# EAGLE design Thermorad-A (EAGLE 6.3)
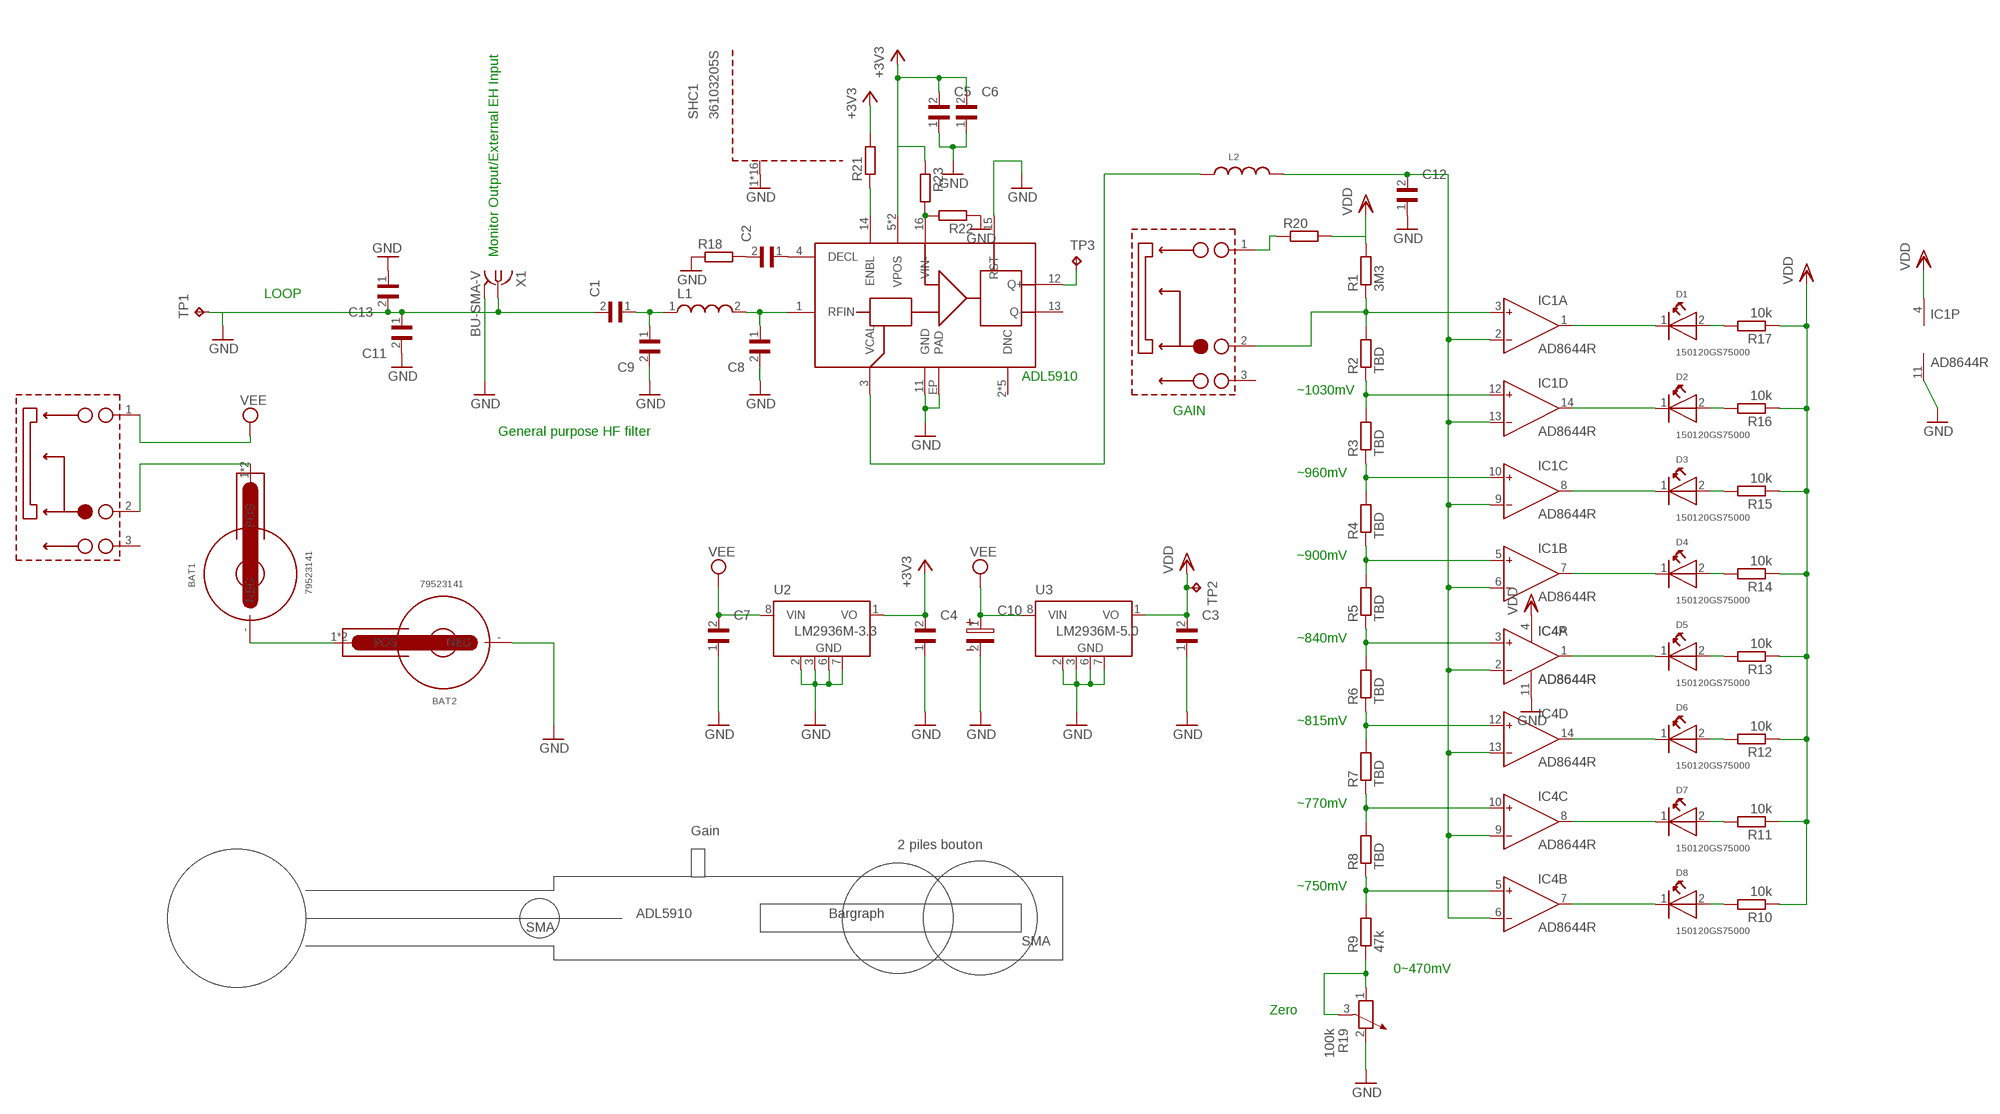
[diagram p0: schematic, sheet 1]

## Parts
BAT1  79523141  WA-BCMC_SMT_79523141  [79523141]
BAT2  79523141  WA-BCMC_SMT_79523141  [79523141]
C1  WCAP-CSGP_0805-REFLOW  [WCAP-CSGP_0805_REFLOW]
C2  WCAP-CSGP_0805-REFLOW  [WCAP-CSGP_0805_REFLOW]
C3  WCAP-CSGP_0805-REFLOW  [WCAP-CSGP_0805_REFLOW]
C4  WCAP-CSGP_0805-REFLOW  [WCAP-CSGP_0805_REFLOW]
C5  WCAP-CSGP_0805-REFLOW  [WCAP-CSGP_0805_REFLOW]
C6  WCAP-CSGP_0805-REFLOW  [WCAP-CSGP_0805_REFLOW]
C7  WCAP-CSGP_0805-REFLOW  [WCAP-CSGP_0805_REFLOW]
C8  WCAP-CSGP_0805-REFLOW  [WCAP-CSGP_0805_REFLOW]
C9  WCAP-CSGP_0805-REFLOW  [WCAP-CSGP_0805_REFLOW]
C10  WCAP-ASLI_5X5.5(DXL)  [3X1.6X1.4(BXCXA)]
C11  WCAP-CSGP_0805-REFLOW  [WCAP-CSGP_0805_REFLOW]
C12  WCAP-CSGP_0805-REFLOW  [WCAP-CSGP_0805_REFLOW]
C13  WCAP-CSGP_0805-REFLOW  [WCAP-CSGP_0805_REFLOW]
D1  150120GS75000  WL-SMCW-150120GS75000-G  [1206]
D2  150120GS75000  WL-SMCW-150120GS75000-G  [1206]
D3  150120GS75000  WL-SMCW-150120GS75000-G  [1206]
D4  150120GS75000  WL-SMCW-150120GS75000-G  [1206]
D5  150120GS75000  WL-SMCW-150120GS75000-G  [1206]
D6  150120GS75000  WL-SMCW-150120GS75000-G  [1206]
D7  150120GS75000  WL-SMCW-150120GS75000-G  [1206]
D8  150120GS75000  WL-SMCW-150120GS75000-G  [1206]
IC1  AD8644R  [SO14]
IC4  AD8644R  [SO14]
L1  WE-KI_0805A  [WE-KI_0805A]
L2  WE-CBF_0805_74279209_WB_HS  [WE-CBF_0805(W=3.0)]
R1  3M3  R-EU_M0805  [M0805]
R2  TBD  R-EU_M0805  [M0805]
R3  TBD  R-EU_M0805  [M0805]
R4  TBD  R-EU_M0805  [M0805]
R5  TBD  R-EU_M0805  [M0805]
R6  TBD  R-EU_M0805  [M0805]
R7  TBD  R-EU_M0805  [M0805]
R8  TBD  R-EU_M0805  [M0805]
R9  47k  R-EU_M0805  [M0805]
R10  10k  R-EU_M0805  [M0805]
R11  10k  R-EU_M0805  [M0805]
R12  10k  R-EU_M0805  [M0805]
R13  10k  R-EU_M0805  [M0805]
R14  10k  R-EU_M0805  [M0805]
R15  10k  R-EU_M0805  [M0805]
R16  10k  R-EU_M0805  [M0805]
R17  10k  R-EU_M0805  [M0805]
R18  R-EU_R0603  [R0603]
R19  100k  POTENTIOMETER_PT_SPIN  [PT-SPIN]
R20  R-EU_M0805  [M0805]
R21  R-EU_R0603  [R0603]
R22  R-EU_R0603  [R0603]
R23  R-EU_R0603  [R0603]
SHC1  36103205S  WE-SHC_36103205S  [WE-SHC_36103205S]
SW1  450404015514  [450404015514]
SW2  450404015514  [450404015514]
TP1  TPB2,54  [B2,54]
TP2  TPB2,54  [B2,54]
TP3  TPB1,27  [B1,27]
U1  ADL5910  [LFCSP-16]
U2  LM2936M-3.3  [SO08]
U3  LM2936M-5.0  [SO08]
X1  BU-SMA-V  [BU-SMA-V]

## Nets
+3V3: C4.2 C5.2 C6.2 R21.2 R23.1 U1.5(VPOS) U1.7(VPOS) U2.1(VO)
GND: BAT2.-(NEG) C1.2 C3.1 C4.1 C5.1 C6.1 C7.1 C8.2 C9.2 C10.2 C11.1 C11.2 C12.1 C13.1 C13.2 IC1.11(P:V-) IC4.11(P:V-) R18.1 R19.2 R22.1 SHC1.1(GND) SHC1.2(GND) SHC1.3(GND) SHC1.4(GND) SHC1.5(GND) SHC1.6(GND) SHC1.7(GND) SHC1.8(GND) SHC1.9(GND) SHC1.10(GND) SHC1.11(GND) SHC1.12(GND) SHC1.13(GND) SHC1.14(GND) SHC1.15(GND) SHC1.16(GND) TP1.TP U1.11(GND) U1.15(RST) U1.EP(PAD) U2.2(GND) U2.3(GND) U2.6(GND) U2.7(GND) U3.2(GND) U3.3(GND) U3.6(GND) U3.7(GND) X1.1 X1.2(GND)
N$1: IC4.5(B:IN+) R8.1 R9.2
N$2: IC4.10(C:IN+) R7.1 R8.2
N$3: IC4.12(D:IN+) R6.1 R7.2
N$4: IC4.3(A:IN+) R5.1 R6.2
N$5: IC1.5(B:IN+) R4.1 R5.2
N$6: IC1.10(C:IN+) R3.1 R4.2
N$7: IC1.12(D:IN+) R2.1 R3.2
N$8: IC1.3(A:IN+) R1.1 R2.2 SW1.2
N$9: C1.1 C9.1 L1.1
N$10: D8.2(A) R10.2
N$11: C8.1 L1.2 U1.1(RFIN)
N$12: D3.1(K) IC1.8(C:OUT)
N$13: D4.1(K) IC1.7(B:OUT)
N$14: D5.1(K) IC4.1(A:OUT)
N$15: D6.1(K) IC4.14(D:OUT)
N$16: D7.1(K) IC4.8(C:OUT)
N$17: D8.1(K) IC4.7(B:OUT)
N$18: D2.1(K) IC1.14(D:OUT)
N$19: D1.1(K) IC1.1(A:OUT)
N$21: D7.2(A) R11.2
N$22: D6.2(A) R12.2
N$23: D5.2(A) R13.2
N$24: D4.2(A) R14.2
N$25: D3.2(A) R15.2
N$26: D2.2(A) R16.2
N$27: D1.2(A) R17.2
N$28: BAT1.1(POS) BAT1.2(POS) SW2.2
N$29: BAT1.-(NEG) BAT2.1(POS) BAT2.2(POS)
N$30: R20.1 SW1.1
N$31: C2.1 U1.4(DECL)
N$32: C2.2 R18.2
N$33: C12.2 IC1.2(A:IN-) IC1.6(B:IN-) IC1.9(C:IN-) IC1.13(D:IN-) IC4.2(A:IN-) IC4.6(B:IN-) IC4.9(C:IN-) IC4.13(D:IN-) L2.2
N$34: R9.1 R19.1 R19.3
N$35: L2.1 U1.3(VCAL)
N$36: R21.1 U1.14(ENBL)
N$38: R22.2 R23.2 U1.16(VIN-)
N$40: TP3.TP U1.12(Q+)
VDD: C3.2 IC1.4(P:V+) IC4.4(P:V+) R1.2 R10.1 R11.1 R12.1 R13.1 R14.1 R15.1 R16.1 R17.1 R20.2 TP2.TP U3.1(VO)
VEE: C7.2 C10.1 SW2.1 U2.8(VIN) U3.8(VIN)
Unconnected: SW1.3 SW2.3 U1.2(DNC) U1.6(DNC) U1.8(DNC) U1.9(DNC) U1.10(DNC) U1.13(Q-)

## Notes on the sheet
- Monitor Output/External EH Input
- LOOP
- ADL5910
- ~1030mV
- GAIN
- General purpose HF filter
- ~960mV
- ~900mV
- ~840mV
- ~815mV
- ~770mV
- Gain
- 2 piles bouton
- ~750mV
- ADL5910 | Bargraph
- SMA
- SMA
- 0~470mV
- Zero

## Power pins joined to a net without a drawn wire
GND: X1.3(GND) X1.4(GND) X1.5(GND)

## Library data of the parts
BAT1 BAT2 = EAGLE-BATTERY_HOLDERS:WA-BCMC: Battery Holder WA-BCMC Characteristics Material : Phosphor Bronze Surface:Nichel Comliance:Lead free and RoHs Packaging unit is 500 <http://katalog.we-online.de/media/images/v2/Family_WA-BCMC_Battery_Holder_795xxxxx.jpg> Details see: http://katalog.we-online.de/en/em/BCMC_BATTERY_HOLDER/79523141 2015 (C) Wurth Elektronik
C1-C9 C11-C13 = Eagle_Wurth_Elektronik_Passive_Capacitors_rev15a:WCAP-CSGP: WCAP-CSGP Ceramic Capacitors Characteristics Multilayer Ceramic Chip Capacitor Recommended soldering:Reflow, for 0603 and 0805 wave soldering is also allowed Operating temperature:-55 °C to +125 °C; Ceramic characteristics: Class I - NPO ; Class II -X7R, X5R High performance ceramic High capacitance stability Minimal aging Termination:Cu/Ni/Sn <http://katalog.we-online.de/media/images/eisos/WCAP-CSGP_pf2.jpg> Details see: http://katalog.we-online.de/en/pbs/WCAP-CSGP/?m Created: 2015-01-28 2015 (C) Wurth Elektronik
C10 = Eagle_Wurth_Elektronik_Passive_Capacitors_rev15a:WCAP-ASLI: WCAP-ASLI Aluminum Electrolytic Capacitors Characteristics Aluminum Electrolytic Capacitor Recommended soldering: Reflow Operating temperature: -55 °C to +105 °C Low impedance product series Load life:2000 h @ +105 °C Package name and Variant abbreviation: Package: Package: B X C X A = length of the solder pad X width of the solder pad X pitch of the solder pad. Variant: D X L = Diameter of the body part X Height of the body part. <http://katalog.we-online.de/media/images/eisos/WCAP-ASLI_pf2.jpg> Details see: http://katalog.we-online.de/en/pbs/WCAP-ASLI?m Created: 2015-03-10 2015 (C) Wurth Elektronik
D1-D8 = Wurth_Elektronik_Optoelectronics_rev15b:WL-SMCW: SMD mono-color Chip LED Characteristics Low energy consumption High reliability Low current requirement Fast switching No UV/IR radiation Smallest SMD package with exceptional brightness Top view Wide viewing angle PBC high-usage Applications Backlight for mobile and portable device keypads Indoor and outdoor message boards Flat backlight for LCDs, switches and symbols Display for industrial control systems and traffic Miniaturized color effects Pedestrian mark Optical indicators General lighting Toys <http://katalog.we-online.de/media/images/eipal/WL-SMCW_pf2.jpg> Details see: http://katalog.we-online.de/en/led/WL-SMCW?m Updated 2015-04-10 2015 (C) Wurth Elektronik; COMPANY-URL: http://www.we-online.de; CREATED-BY: Christin Otto; CREATED-DATE: APR 2013; DATASHEET-URL: http://katalog.we-online.de/en/led/WL-SMCW?m=t&sq=smcw&sp=&sp=http%3A%2F%2Fwww.we-online.de%2Fweb%2Fen%2Felectronic_components%2Fsearchpage_PBS.php%3Fsearch%3Dsmcw#vs_t2:2; MANUFACTURER: Würth Elektronik eiSos GmbH
IC1 IC4 = analog-devices:AD8644: Single and Quad 18 V Operational Amplifiers Source: http://www.analog.com/static/imported-files/data_sheets/AD8614_8644.pdf; MF: ALTERA CORPORATION; MPN: AD8644ARZ; OC_FARNELL: 1438873; OC_NEWARK: 59K7037
L1 = EAGLE-EMC_COMPONENTS-rev17a:WE-KI: SMD Wire Wound Ceramic Inductor Characteristics WE-KI series offers you an excellent Q factor and highest possible self resonant frequencies up to 12.5 GHz Inductance tolerances: 5% (2% on request) High thermal stability Operating temperature: –40°C to +125°C Applications Especially developed for high frequency applications RF transceiver/communications Bluetooth Wireless LAN <http://katalog.we-online.de/media/images/v2/Family_WE-KI.jpg> Details see: http://katalog.we-online.de/en/pbs/WE-KI Updated by Dan Xu 2014-07-08 2014 (C) Wurth Elektronik
L2 = EMCComponents (rev19a):WE-CBF_0805: WE-CBF SMD EMI Suppression Ferrite Bead Characteristics Reliable Ni-Sn electrodes High rated current up to 6 A Operating temperature: –55 ºC to +125 ºC Applications Perfect as data lined filter and for uncoupling of distribution voltage Variant abbreviation WB means WIDE BAND HS means HIGH SPEED HC means HIGH CURRENT <http://katalog.we-online.de/media/images/v2/Family_WE-CBF.jpg> Details see: http://katalog.we-online.de/en/pbs/WE-CBF Updated on 2014-06-19 2014 (C) Wurth Elektronik; WE-NUMBER: 74279209/1200Ω(Z@100MHz)
R1-R17 R20 = resistor:R-EU_: RESISTOR, European symbol
R18 R21-R23 = rcl:R-EU_: RESISTOR, European symbol
R19 = rcl:POTENTIOMETER_: Potentiometer
SHC1 = EMCComponents (rev19a):WE-SHC: Shielding Cabinet Characteristics Tin plate in accordance with DIN EN 10202/10203 Shielding effectiveness up to 55 dB Two-part case consisting of a solderable grid frame (SMD/THT) and a removable cover Applications To prevent EMI radiation from PCB and to keep sensitivity low of: - RF output stages - RF input and amplifier stages; - Oscillators - EMC sensitive parts in plastic cases <http://katalog.we-online.de/media/images/v2/Family_WE-SHC_NEU_2017.jpg> Details see: http://katalog.we-online.de/en/pbs/WE-SHC?m Updated by Dan Xu 2014-07-11 2014 (C) Wurth Elektronik
SW1 SW2 = EAGLE-450404015514-rev1:450404015514: WS-SLSU Right angle Slide Switch with boss design Specification Rating 300mA, 12VDC Contact Resistance Initial:70mΩ max. After life test: 200mΩ max. Insulation Resistance: min.100MΩ at 500VDC Dielectric Strength : 250VAC for 1 minute Travel:1.5±0.15mm Operating force :150 ± 75g. Life cycle:10000 steps Switch function : ON-ON. Material Cover : : Stainless Steel Base :PA46 UL 94 HB,COLOR Black Frame :LCP UL 94 V-0, color Black Contact : :Copper Alloy with Silver Terminal : Copper Alloy with Silver 2015 (C) Wurth Elektronik
TP1-TP3 = testpad:TP: Test pad
U1 = LT:ADL5910
U2 = national-semiconductor:LM2936M?*: Ultra-Low Quiescent Current LDO Voltage Regulator Source: Data sheet <http://www.national.com/ds/LM/LM2936.pdf>; MF: NATIONAL SEMICONDUCTOR; MPN: LM2936M-3.3/NOPB; OC_FARNELL: 1469059; OC_NEWARK: 41K4514
U3 = national-semiconductor:LM2936M?*: Ultra-Low Quiescent Current LDO Voltage Regulator Source: Data sheet <http://www.national.com/ds/LM/LM2936.pdf>; MF: NATIONAL SEMICONDUCTOR; MPN: LM2936M-5.0/NOPB; OC_FARNELL: 9494421; OC_NEWARK: 41K4515
X1 = con-coax:BU-SMA-V: FEMALE SMA CONNECTOR Radiall distributor RS 112-3794; OC_FARNELL: unknown; OC_NEWARK: unknown

## Board
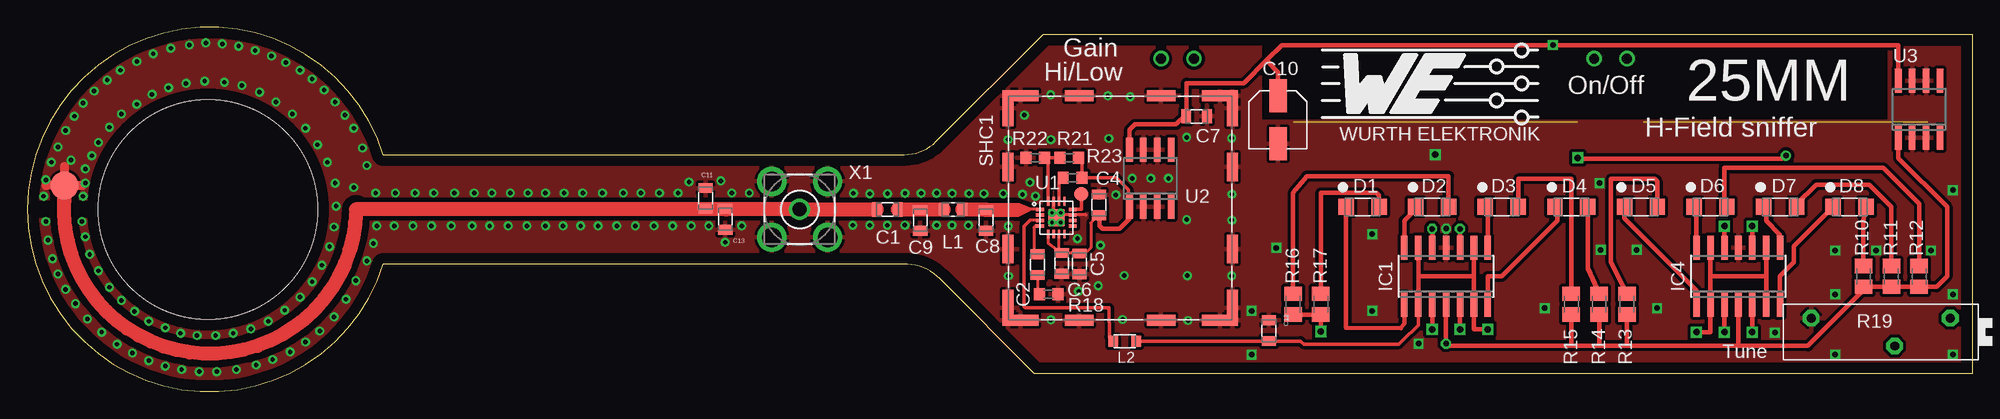
[diagram p1: board, top side]
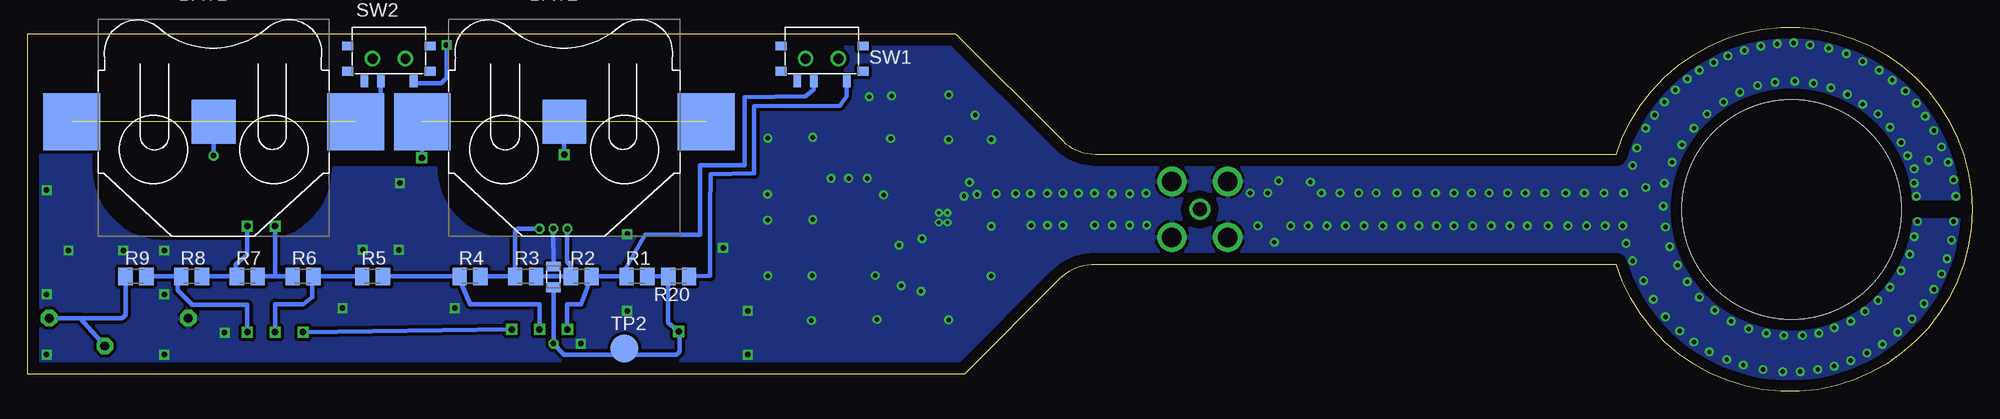
[diagram p2: board, bottom side, seen from below]

Size 177.49 x 33.21 mm. Coordinates in mm from the lower left corner, seen from the top.
Outline: 32.49,21.61 arc325 32.49,11.61 80.34,11.61 arc-45 83.28,10.27 91.94,1.61 177.49,1.61 177.49,32.61 92.74,32.61 82.95,22.82 arc-45 80.02,21.61 32.49,21.61
Copper layers (1*16): Top 0.035mm / dielectric 1.5mm / Bottom 0.035mm
Design rules "default *": minimum track width 10mil, minimum drill 24mil, track to track 0.15mm, track to pad 0.15mm, pad to pad 0.15mm, via to via 0.15mm, smd to smd 0.15mm, copper to edge 40mil, drill to drill 8mil, minimum pad ring 10mil, minimum via ring 8mil, stop-mask expansion 4mil, vias tented up to drill 0mil, thermal gap 10mil
Holes 20 mm at 16.49,16.61
tRestrict: area 69.3,15.4 to 71.7,17.8; 11 lines
bRestrict: area 69.3,15.4 to 71.7,17.8; 1 lines

### Footprints (pad centres in the part's own frame; a part is rotated, then mirrored left to right if it is on the bottom)
79523141 = smd 5.2 x 5.2: 1 -12.95,0; 2 12.95,0 | smd 4 x 4: - 0,0
WCAP-CSGP_0805_REFLOW = smd 0.9 x 1.3: 1 -0.95,0; 2 0.95,0
3X1.6X1.4(BXCXA) = smd 3 x 1.6: 1 2.2,0; 2 -2.2,0
1206 = smd 1.4 x 1.5: 1 -1.5,0; 2 1.5,0
SO14 = smd 0.6 x 2.2: 1 -3.81,-2.6; 2 -2.54,-2.6; 3 -1.27,-2.6; 4 0,-2.6; 5 1.27,-2.6; 6 2.54,-2.6; 7 3.81,-2.6; 8 3.81,2.6; 9 2.54,2.6; 10 1.27,2.6; 11 0,2.6; 12 -1.27,2.6; 13 -2.54,2.6; 14 -3.81,2.6
WE-KI_0805A = smd 0.925 x 1.2: 1 -0.838,0; 2 0.838,0
WE-CBF_0805(W=3.0) = smd 0.9 x 1: 1 -1.05,0; 2 1.05,0
M0805 = smd 1.3 x 1.6: 1 -0.95,0; 2 0.95,0
R0603 = smd 1 x 1.1: 1 -0.85,0; 2 0.85,0
PT-SPIN = drill 0.813 pad 1.524 octagon: 1 -6.35,-1.27; 2 6.35,-1.27; 3 -1.27,1.27
WE-SHC_36103205S = smd 2.6 x 1: 1 -3.75,10.25; 2 3.75,10.25; 7 -3.75,-10.25; 8 3.75,-10.25 | smd 1 x 2.6: 3 -10.25,3.75; 4 -10.25,-3.75; 5 10.25,-3.75; 6 10.25,3.75 | smd 3.3 x 1: 9 -9.1,10.25; 11 9.1,10.25; 13 -9.1,-10.25; 15 9.1,-10.25 | smd 1 x 3.3: 10 -10.25,9.1; 12 10.25,9.1; 14 -10.25,-9.1; 16 10.25,-9.1
450404015514 = smd 0.7 x 1.1: 1 2.25,-2.05; 2 -0.75,-2.05; 3 -2.25,-2.05 | smd 1 x 0.8: Z1 -3.75,1.15; Z2 3.75,1.15; Z3 3.75,-1.15; Z4 -3.75,-1.15 | drill 0.9: Z5 -1.5,0; Z6 1.5,0
B2,54 = smd 2.54 x 2.54: TP 0,0
B1,27 = smd 1.27 x 1.27: TP 0,0
LFCSP-16 = smd 0.8 x 0.305: 1 -1.5,0.75; 2 -1.5,0.25; 3 -1.5,-0.25; 4 -1.5,-0.75; 9 1.5,-0.75; 10 1.5,-0.25; 11 1.5,0.25; 12 1.5,0.75 | smd 0.305 x 0.8: 5 -0.75,-1.5; 6 -0.25,-1.5; 7 0.25,-1.5; 8 0.75,-1.5; 13 0.75,1.5; 14 0.25,1.5; 15 -0.25,1.5; 16 -0.75,1.5 | smd 1.5 x 1.6: EP 0,0
SO08 = smd 0.6 x 2.2: 1 -1.905,-2.6; 2 -0.635,-2.6; 3 0.635,-2.6; 4 1.905,-2.6; 5 1.905,2.6; 6 0.635,2.6; 7 -0.635,2.6; 8 -1.905,2.6
BU-SMA-V = drill 1.27: 1 0,0 | drill 1.778: 2 -2.55,2.55; 3 2.55,2.55; 4 2.55,-2.55; 5 -2.55,-2.55

### Placement (x,y rotation side)
BAT1  160.49,24.61 0 bottom
BAT2  128.49,24.61 0 bottom
C1  78.49,16.61 180 top
C2  92.2,11.58 270 top
C3  129.48,10.45 270 bottom
C4  97.8,17.02 270 top
C5  96.02,11.64 90 top
C6  94.4,11.68 90 top
C7  106.72,25.1 180 top
C8  87.49,15.61 270 top
C9  81.49,15.61 270 top
C10  114.14,24.79 90 top
C11  61.89,17.61 90 top
C12  113.31,5.55 270 top
C13  63.69,15.71 90 top
D1  121.86,16.85 0 top
D2  128.21,16.85 0 top
D3  134.56,16.85 0 top
D4  140.91,16.85 0 top
D5  147.26,16.85 0 top
D6  153.61,16.85 0 top
D7  159.96,16.85 0 top
D8  166.31,16.85 0 top
IC1  129.48,10.5 0 top
IC4  156.15,10.5 0 top
L1  84.49,16.61 0 top
L2  100.15,4.59 0 top
R1  121.86,10.5 0 bottom
R2  126.94,10.5 0 bottom
R3  132.02,10.5 0 bottom
R4  137.1,10.5 0 bottom
R5  145.99,10.5 0 bottom
R6  152.34,10.5 0 bottom
R7  157.42,10.5 0 bottom
R8  162.5,10.5 0 bottom
R9  167.58,10.5 0 bottom
R10  167.58,10.5 90 top
R11  170.12,10.5 90 top
R12  172.66,10.5 90 top
R13  145.99,7.96 90 top
R14  143.45,7.96 90 top
R15  140.91,7.96 90 top
R16  115.51,7.96 90 top
R17  118.05,7.96 90 top
R18  93.22,8.88 180 top
R19  169.15,5.42 180 top
R20  118.05,10.5 180 bottom
R21  95.39,19.51 0 top
R22  91.99,21.31 0 top
R23  95.09,21.31 180 top
SHC1  99.73,16.73 270 top
SW1  104.97,30.36 0 bottom
SW2  144.49,30.36 0 bottom
TP1  3.4,18.77 0 top
TP2  122.99,3.91 0 bottom
TP3  96.19,18.01 0 top
U1  93.91,15.86 0 top
U2  102.49,19.44 0 top
U3  172.66,25.74 0 top
X1  70.49,16.61 0 top

### Tracks (layer width: path | path; a pad name or v marks a point on that pad's centre or on a via)
+3V3
  Top 0.254: U1.5 93.16,13.5 C6.2 94.14,12.65 94.31,12.62 | 94.31,12.62 arc-90 94.16,12.77 U1.7 | 94.31,12.62 95.26,12.62 arc-90 C5.2 95.36,12.62 96.56,12.62 97.06,13.12 97.06,15.37 97.81,16.12 97.84,16.15
  Top 0.305: U2.1 100.49,16.93 100.49,18.41 99.39,19.51 R21.2 96.24,21.31 R23.1
  Top 0.406: 97.81,16.12 C4.2 97.84,16.03 97.84,15.14 98.12,14.86 99.69,14.86 100.58,15.75 U2.1
GND  (via drill 0.3 pad 0.41, 0.4 pad 0.41, 0.5, 0.6)
  Top 0.254: 94.16,16.11 U1.11 96.66,16.11 | 94.16,16.11 arc90 U1.EP | 94.16,16.11 94.16,16.16 v94.3,16.3
  Top 0.305: U1.15 93.66,16.3 v93.52,16.3 | C11.1 C13.2 63.74,16.66 63.79,16.61
  Top 0.406: v129.49,14.86 129.49,15.11 | X1.1 arc279 70.53,16.61 | 3.49,18.61 3.4,18.61 TP1.TP 3.4,18.8 3.39,18.81
  Top 0.8: 3.39,18.81 4.99,18.81 | 3.39,18.81 3.39,20.51 | 3.39,18.81 1.69,18.81
  Top 1.27: 3.49,18.61 arc96 16.04,3.46 arc92 29.99,16.61 63.79,16.61 70.53,16.61 C1.2
  Bottom 0.406: BAT2.- v128.49,21.61 | C3.1 IC1.11 v129.49,14.86
  other vias: 175.74,3.36 175.74,8.86 175.74,18.36 164.99,8.86 164.99,12.86 168.74,12.86 173.74,12.86 164.99,3.36 159.49,5.36 148.74,7.61 138.49,7.61 122.74,7.36 122.74,14.36 111.74,3.36 111.74,7.36 113.99,13.11 1.69,15.51 1.89,13.81 2.29,12.11 2.79,10.71 3.49,9.31 4.39,8.01 5.49,6.61 6.79,5.41 8.19,4.31 9.59,3.51 11.09,2.81 12.59,2.31 14.09,2.01 15.69,1.81 17.29,1.81 19.09,2.01 20.89,2.41 22.39,2.91 23.99,3.61 25.39,4.51 26.69,5.51 4.99,15.51 5.29,14.11 5.69,12.51 6.49,11.01 7.49,9.51 8.59,8.31 9.79,7.31 11.09,6.41 12.59,5.81 13.99,5.31 15.49,5.11 17.19,5.11 18.79,5.31 20.39,5.71 21.99,6.41 23.49,7.41 24.89,8.61 27.99,6.81 25.99,10.01 29.09,8.41 26.89,11.51 29.99,10.11 27.59,13.21 27.99,15.01 28.19,16.91 28.09,19.01 30.99,11.91 31.59,13.51 31.89,15.11 5.09,17.81 5.29,19.01 5.29,20.31 3.99,21.11 2.19,20.91 1.49,17.81 1.69,19.31 29.79,18.61 31.79,18.11 30.99,20.61 27.39,20.91 26.49,22.51 30.59,22.21 25.39,24.01 24.19,25.31 22.69,26.41 21.19,27.31 19.59,27.91 17.99,28.21 16.19,28.31 14.49,28.11 12.89,27.71 11.39,27.11 9.99,26.21 8.59,25.31 7.49,24.11 6.49,22.71 5.89,21.51 2.79,22.31 3.49,23.81 4.29,25.11 5.09,26.31 6.09,27.41 7.29,28.41 8.49,29.31 9.99,30.11 11.49,30.81 13.09,31.31 14.79,31.61 16.29,31.81 17.79,31.71 19.29,31.51 20.79,31.11 22.29,30.61 23.59,30.01 24.89,29.31 25.99,28.51 27.09,27.51 28.09,26.41 28.99,25.21 29.79,24.01 33.49,15.11 35.19,15.11 36.89,15.11 38.69,15.11 40.59,15.11 42.19,15.11 43.89,15.11 45.59,15.11 47.29,15.11 42.39,18.11 33.59,18.11 35.39,18.11 37.09,18.11 38.99,18.11 40.79,18.11 44.09,18.11 48.89,15.11 50.49,15.11 52.09,15.11 53.79,15.11 55.49,15.11 57.19,15.11 58.89,15.11 60.59,15.11 62.19,15.11 63.69,13.61 65.19,15.11 45.69,18.11 47.29,18.11 48.99,18.11 50.69,18.11 52.49,18.11 54.39,18.11 55.99,18.11 57.69,18.11 59.39,18.11 60.39,19.11 63.29,19.21 64.29,18.11 65.89,18.11 75.39,18.08 76.89,18.04 78.5,18.05 80.1,18.08 81.57,18.08 82.99,18.09 84.4,18.07 85.94,18.06 87.3,18.05 89.07,18.05 90.82,17.98 92.01,17.82 75.33,15.16 76.89,15.16 78.48,15.16 82.99,15.16 84.39,15.16 85.89,15.15 89.52,15.07 80.09,15.17 143.59,12.91 143.49,19.01 146.89,12.91 93.52,15.42 94.3,15.42 89.51,22.98 91,25.21 93.4,27.06 98.61,26.97 100.66,26.89 109.91,23.11 109.94,17.99 105.93,6.47 109.92,10.55 105.87,10.57 89.54,10.54 93.41,6.53 109.93,15.63 99.96,6.56 126.98,4.36 95.94,9.14 97.74,9.64 97.94,13.34 100.84,19.44 102.54,19.44 104.14,19.44 93.41,22.98 98.71,23.08 91.51,19.08 100.11,10.58 105.81,15.68 105.81,23.18 99.34,17.94 95.84,13.94
  pour Top (isolate 0.3): 111.97,24.47 112.49,24.61 169.99,24.61 169.99,31.86 176.47,31.86 176.47,1.88 111.97,1.88
  pour Top (isolate 0.3): -0.51,36.61 -0.51,-0.39 112.49,1.61 112.49,36.61
  pour Bottom (isolate 0.3): -0.51,36.61 -0.51,-0.39 110.49,1.61 110.49,35.61 109.49,36.61
  pour Bottom (isolate 0.3): 176.49,31.61 176.49,2.86 109.74,2.86 109.74,25.11 111.99,25.11 111.99,20.86 116.99,20.86 arc90 123.99,13.86 124.24,13.86 133.49,13.86 133.74,13.86 arc90 140.24,20.36 149.49,20.36 arc90 156.24,13.61 164.74,13.61 164.99,13.61 arc90 171.74,20.36 171.74,31.61
N$1  (via drill 0.6)
  Top 0.406: v157.42,5.42 IC4.5
  Bottom 0.406: R9.2 R8.1 163.77,10.18 163.77,9.23 162.44,7.9 IC4.5 v157.42,5.42
N$2  (via drill 0.6)
  Top 0.406: v157.42,15.08 IC4.10
  Bottom 0.406: v157.42,15.08 157.42,12.45 158.49,11.61 158.49,10.62 R7.1 R8.2
N$3  (via drill 0.6)
  Top 0.406: v154.88,15.08 IC4.12
  Bottom 0.406: R6.1 154.88,10.5 | R7.2 154.88,10.5 | 154.88,10.5 v154.88,15.08
N$4  (via drill 0.6)
  Top 0.406: IC4.3 v154.88,5.42
  Bottom 0.406: v154.88,5.42 154.88,7.96 152.34,7.96 151.49,8.61 151.49,10.4 arc90 R6.2 R5.1
N$5  (via drill 0.6)
  Top 0.406: IC1.5 v130.75,5.67
  Bottom 0.406: v130.75,5.67 130.75,7.96 137.1,7.96 138.05,10.18 R4.1 R5.2
N$6  (via drill 0.5)
  Top 0.406: v130.75,14.83 IC1.10
  Bottom 0.406: v130.75,14.83 130.75,14.86 132.74,14.86 132.97,14.63 R3.1 R4.2
N$7  (via drill 0.5)
  Top 0.406: v128.21,14.83 IC1.12
  Bottom 0.406: v128.21,14.83 128.21,11.77 127.89,11.45 R2.1 R3.2
N$8  (via drill 0.6)
  Top 0.406: v128.21,5.67 IC1.3
  Bottom 0.406: v128.21,5.67 128.21,7.96 126.94,7.96 R2.2 R1.1 123.13,10.82 121.13,14.31 116.09,14.32 116.08,20.64 112.03,20.64 112.03,26.83 106.46,26.94 105.72,27.52 SW1.2
N$9
  Top 0.254: C1.1 arc90 79.49,16.56 C9.1
  Top 1.27: C1.1 L1.1
N$10
  Top 0.406: D8.2 167.58,15.58 R10.2
N$11
  Top 0.254: U1.1 91.31,16.62
  Top 0.4: 91.31,16.62 90.31,16.62
  Top 0.406: 90.31,16.57 90.31,16.62
  Top 1.27: L1.2 87.49,16.61 C8.1 90.31,16.57
N$12
  Top 0.406: IC1.8 133.29,16.85 D3.1
N$13
  Top 0.406: IC1.7 133.29,10.5 134.56,10.5 139.64,15.58 139.64,16.62 D4.1
N$14
  Top 0.406: D5.1 145.76,15.81 152.34,9.23 IC4.1
N$15
  Top 0.406: D6.1 152.34,16.62 IC4.14
N$16
  Top 0.406: D7.1 158.69,16.62 158.69,15.58 159.96,14.31 IC4.8
N$17
  Top 0.406: D8.1 161.23,13.27 161.23,11.77 159.96,10.5 IC4.7
N$18
  Top 0.406: IC1.14 125.67,15.58 126.71,16.62 D2.1
N$19
  Top 0.406: D1.1 120.36,5.79 125.36,5.77 125.67,6.23 IC1.1
N$20
  Top 0.3: 90.51,17.02 91.51,16.62 90.51,16.12
N$21
  Top 0.406: R11.2 170.12,16.85 168.1,18.87 163.25,18.87 161.46,17.08 D7.2
N$22
  Top 0.406: D6.2 154.88,17.08 154.88,20.39 169.39,20.39 172.66,17.12 R12.2
N$23
  Top 0.406: R13.2 144.52,11.85 144.52,19.39 148.53,19.39 148.76,19.16 D5.2
N$24
  Top 0.406: R14.2 142.41,11.22 D4.2
N$25
  Top 0.406: R15.2 140.91,19.39 136.1,19.39 136.06,19.16 D3.2
N$26
  Top 0.406: D2.2 129.71,19.64 116.78,19.64 115.51,18.12 R16.2
N$27
  Top 0.406: R17.2 118.05,18.12 123.13,18.12 123.36,17.89 D1.2
N$28  (1 unrouted)
  Bottom 0.406: SW2.2 145.24,26.86 147.49,24.61 BAT1.2
N$29  (via drill 0.5, 0.6)  (1 unrouted)
  Top 0.406: v160.49,21.51 160.19,21.21 141.79,21.21 v141.49,21.31
  Bottom 0.406: BAT1.- v160.49,21.51 | v141.49,21.31 141.44,21.66 BAT2.1 | BAT2.2 115.49,24.61
N$30
  Bottom 0.406: SW1.1 102.74,26.94 103.34,26.08 111.16,26.01 111.18,19.89 115.16,19.84 115.17,16.63 115.18,10.55 R20.1
N$31
  Top 0.254: U1.4 92,15.11 91.87,14.95 91.86,12.65 C2.1
N$32
  Top 0.254: C2.2 92.21,9.14 R18.2
N$33  (via drill 0.6)
  Top 0.254: C12.2
  Top 0.305: IC1.2 126.94,6.06 125.49,4.61 125.19,4.31 116.49,4.31 116.2,4.6 C12.2 | L2.2 C12.2
  Top 0.406: IC1.9 132.02,10.5 | 132.02,10.5 IC1.6 132.02,5.67 v133.29,5.67 | 132.02,10.5 126.94,10.5 IC1.2 IC1.13 | 153.61,10.5 IC4.13 | 153.61,10.5 IC4.2 153.61,5.42 v152.34,5.42 | 153.61,10.5 158.69,10.5 | 158.69,10.5 IC4.9 | 158.69,10.5 IC4.6
  Bottom 0.406: v133.29,5.67 v152.34,5.42
N$34
  Bottom 0.406: R19.3 172.66,6.69 | 172.66,6.69 R19.1 | 172.66,6.69 168.85,6.69 168.53,7.01 R9.1
N$35
  Top 0.254: U1.3 91.53,15.61
  Top 0.305: 91.53,15.61 90.98,15.06 90.98,7.75 91.09,7.64 98.73,7.63 98.74,4.95 L2.1
N$36
  Top 0.305: R21.1 94.16,19.13 U1.14
N$38
  Top 0.305: R23.2 R22.2 93.16,20.99 U1.16
N$40
  Top 0.305: U1.12 96.19,16.61 TP3.TP
VDD  (via drill 0.5, 0.6)
  Top 0.406: v118.05,5.47 R17.1 R16.1 | IC1.4 v129.48,4.36 129.48,4.15 140.91,4.15 | 156.15,4.15 162.5,4.15 167.58,9.23 R10.1 R11.1 R12.1 174.25,9.55 175.2,10.5 175.2,16.85 170.75,21.29 U3.1 | IC4.4 156.15,4.15 | 156.15,4.15 145.99,4.15 | 145.99,4.15 143.45,4.15 | 143.45,4.15 140.91,4.15 | R15.1 140.91,4.15 | R14.1 143.45,4.15 | R13.1 145.99,4.15
  Bottom 0.305: TP2.TP 122.99,3.36
  Bottom 0.406: R1.2 R20.2 119,6.27 v118.05,5.47 117.99,5.61 117.99,3.61 118.24,3.36 122.99,3.36 128.49,3.36 v129.48,4.35 v129.48,4.36 C3.2
VEE  (via drill 0.5)
  Top 0.406: U3.8 170.75,31.61 v139.24,31.61 114.49,31.61 113.08,30.2 | U2.8 100.58,23.87 101.07,24.36 104.84,24.36 105.78,25.3 | 105.78,25.3 105.78,28.11 105.81,28.14 111.02,28.14 113.08,30.2 | C10.1 114.14,29.14 113.08,30.2 | 105.78,25.3 C7.2
  Bottom 0.406: SW2.1 142.04,28.11 139.74,28.11 139.24,28.61 v139.24,31.61

### Text on the board
tNames: Gain | Hi/Low | On/Off | 25MM | H-Field sniffer | WURTH ELEKTRONIK | Tune